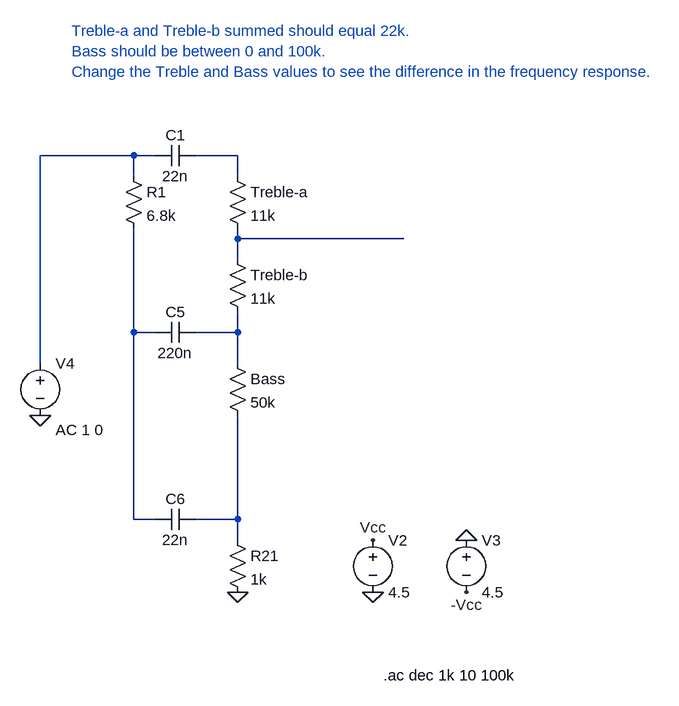
[diagram p0: schematic tone-stack.asc]
tone-stack.asc, the LTspice schematic file:
Version 4
SHEET 1 3668 800
WIRE -368 -656 -512 -656
WIRE -336 -656 -368 -656
WIRE -208 -656 -272 -656
WIRE -368 -624 -368 -656
WIRE -208 -624 -208 -656
WIRE -208 -528 -208 -544
WIRE 48 -528 -208 -528
WIRE -208 -496 -208 -528
WIRE -368 -384 -368 -544
WIRE -336 -384 -368 -384
WIRE -208 -384 -208 -416
WIRE -208 -384 -272 -384
WIRE -512 -336 -512 -656
WIRE -208 -336 -208 -384
WIRE -368 -96 -368 -384
WIRE -336 -96 -368 -96
WIRE -208 -96 -208 -256
WIRE -208 -96 -272 -96
WIRE -208 -64 -208 -96
FLAG 0 16 0
FLAG 144 -64 0
FLAG 0 -64 Vcc
FLAG 144 16 -Vcc
FLAG -512 -256 0
FLAG -208 16 0
SYMBOL voltage 0 -80 R0
SYMATTR InstName V2
SYMATTR Value 4.5
SYMBOL voltage 144 -80 R0
SYMATTR InstName V3
SYMATTR Value 4.5
SYMBOL voltage -512 -352 R0
WINDOW 123 24 118 Left 2
SYMATTR Value2 AC 1 0
SYMATTR InstName V4
SYMATTR Value ""
SYMBOL cap -272 -672 R90
WINDOW 0 0 32 VBottom 2
WINDOW 3 32 32 VTop 2
SYMATTR InstName C1
SYMATTR Value 22n
SYMBOL res -384 -640 R0
SYMATTR InstName R1
SYMATTR Value 6.8k
SYMBOL res -224 -640 R0
SYMATTR InstName Treble-a
SYMATTR Value 11k
SYMBOL cap -272 -400 R90
WINDOW 0 0 32 VBottom 2
WINDOW 3 32 32 VTop 2
SYMATTR InstName C5
SYMATTR Value 220n
SYMBOL cap -272 -112 R90
WINDOW 0 0 32 VBottom 2
WINDOW 3 32 32 VTop 2
SYMATTR InstName C6
SYMATTR Value 22n
SYMBOL res -224 -512 R0
SYMATTR InstName Treble-b
SYMATTR Value 11k
SYMBOL res -224 -80 R0
SYMATTR InstName R21
SYMATTR Value 1k
SYMBOL res -224 -352 R0
SYMATTR InstName Bass
SYMATTR Value 50k
TEXT 16 144 Left 2 !.ac dec 1k 10 100k
TEXT -464 -848 Left 2 ;Treble-a and Treble-b summed should equal 22k.\nBass should be between 0 and 100k.\nChange the Treble and Bass values to see the difference in the frequency response.

The netlist it stands for:
* tone-stack.asc
V2 Vcc 0 4.5
V3 0 -Vcc 4.5
V4 N001 0 AC 1 0
C1 N002 N001 22n
R1 N001 N004 6.8k
R§Treble-a N002 N003 11k
C5 N005 N004 220n
C6 N006 N004 22n
R§Treble-b N003 N005 11k
R21 N006 0 1k
R§Bass N005 N006 50k
.ac dec 1k 10 100k
* Treble-a and Treble-b summed should equal 22k.
* Bass should be between 0 and 100k.
* Change the Treble and Bass values to see the difference in the frequency response.
.backanno
.end